# Altium schematic sheet DCBLOCKx4DIFF.SchDoc
size A3
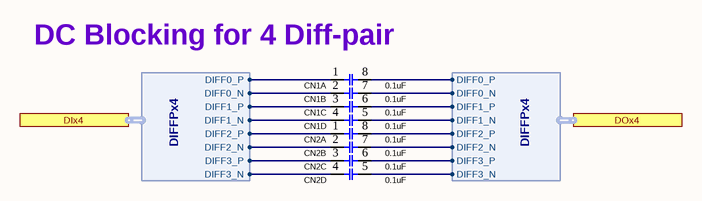
[diagram p0: DCBLOCKx4DIFF.SchDoc]

## Parts
CN1  value 0.1uF  [CP0402X4]  (hidden comment: Film Res Pack)  (parts A,B,C,D of 4)
CN2  value 0.1uF  [CP0402X4]  (hidden comment: Film Res Pack)  (parts A,B,C,D of 4)

## Ports
DIx4 (harness DIFFPx4), DOx4 (harness DIFFPx4)

## Harnesses
DIFFPx4: DIFF0_P, DIFF1_N, DIFF1_P, DIFF2_N, DIFF2_P, DIFF3_N, DIFF3_P, DIFF0_N

## Nets
NetCN1_1: CN1.1 ; port DIx4.DIFF0_P
NetCN1_2: CN1.2 ; port DIx4.DIFF0_N
NetCN1_3: CN1.3 ; port DIx4.DIFF1_P
NetCN1_4: CN1.4 ; port DIx4.DIFF1_N
NetCN1_5: CN1.5 ; port DOx4.DIFF1_N
NetCN1_6: CN1.6 ; port DOx4.DIFF1_P
NetCN1_7: CN1.7 ; port DOx4.DIFF0_N
NetCN1_8: CN1.8 ; port DOx4.DIFF0_P
NetCN2_1: CN2.1 ; port DIx4.DIFF2_P
NetCN2_2: CN2.2 ; port DIx4.DIFF2_N
NetCN2_3: CN2.3 ; port DIx4.DIFF3_P
NetCN2_4: CN2.4 ; port DIx4.DIFF3_N
NetCN2_5: CN2.5 ; port DOx4.DIFF3_N
NetCN2_6: CN2.6 ; port DOx4.DIFF3_P
NetCN2_7: CN2.7 ; port DOx4.DIFF2_N
NetCN2_8: CN2.8 ; port DOx4.DIFF2_P

## Notes on the sheet
- (near CN1) DC Blocking for 4 Diff-pair
- Title
- Size:
- Date:
- A3
- Number:
- Time:
- Revision:
- Sheet
- of
- File:

## Library data of the parts
CN1 CN2 = CAP_SMD_PACK_X4_0508: CAP, SMD, PACKX4; MANF: YAGEO; MANF_P#: CA0508KRX7R7BB104